# EAGLE design Control Board (EAGLE 9.6.2)
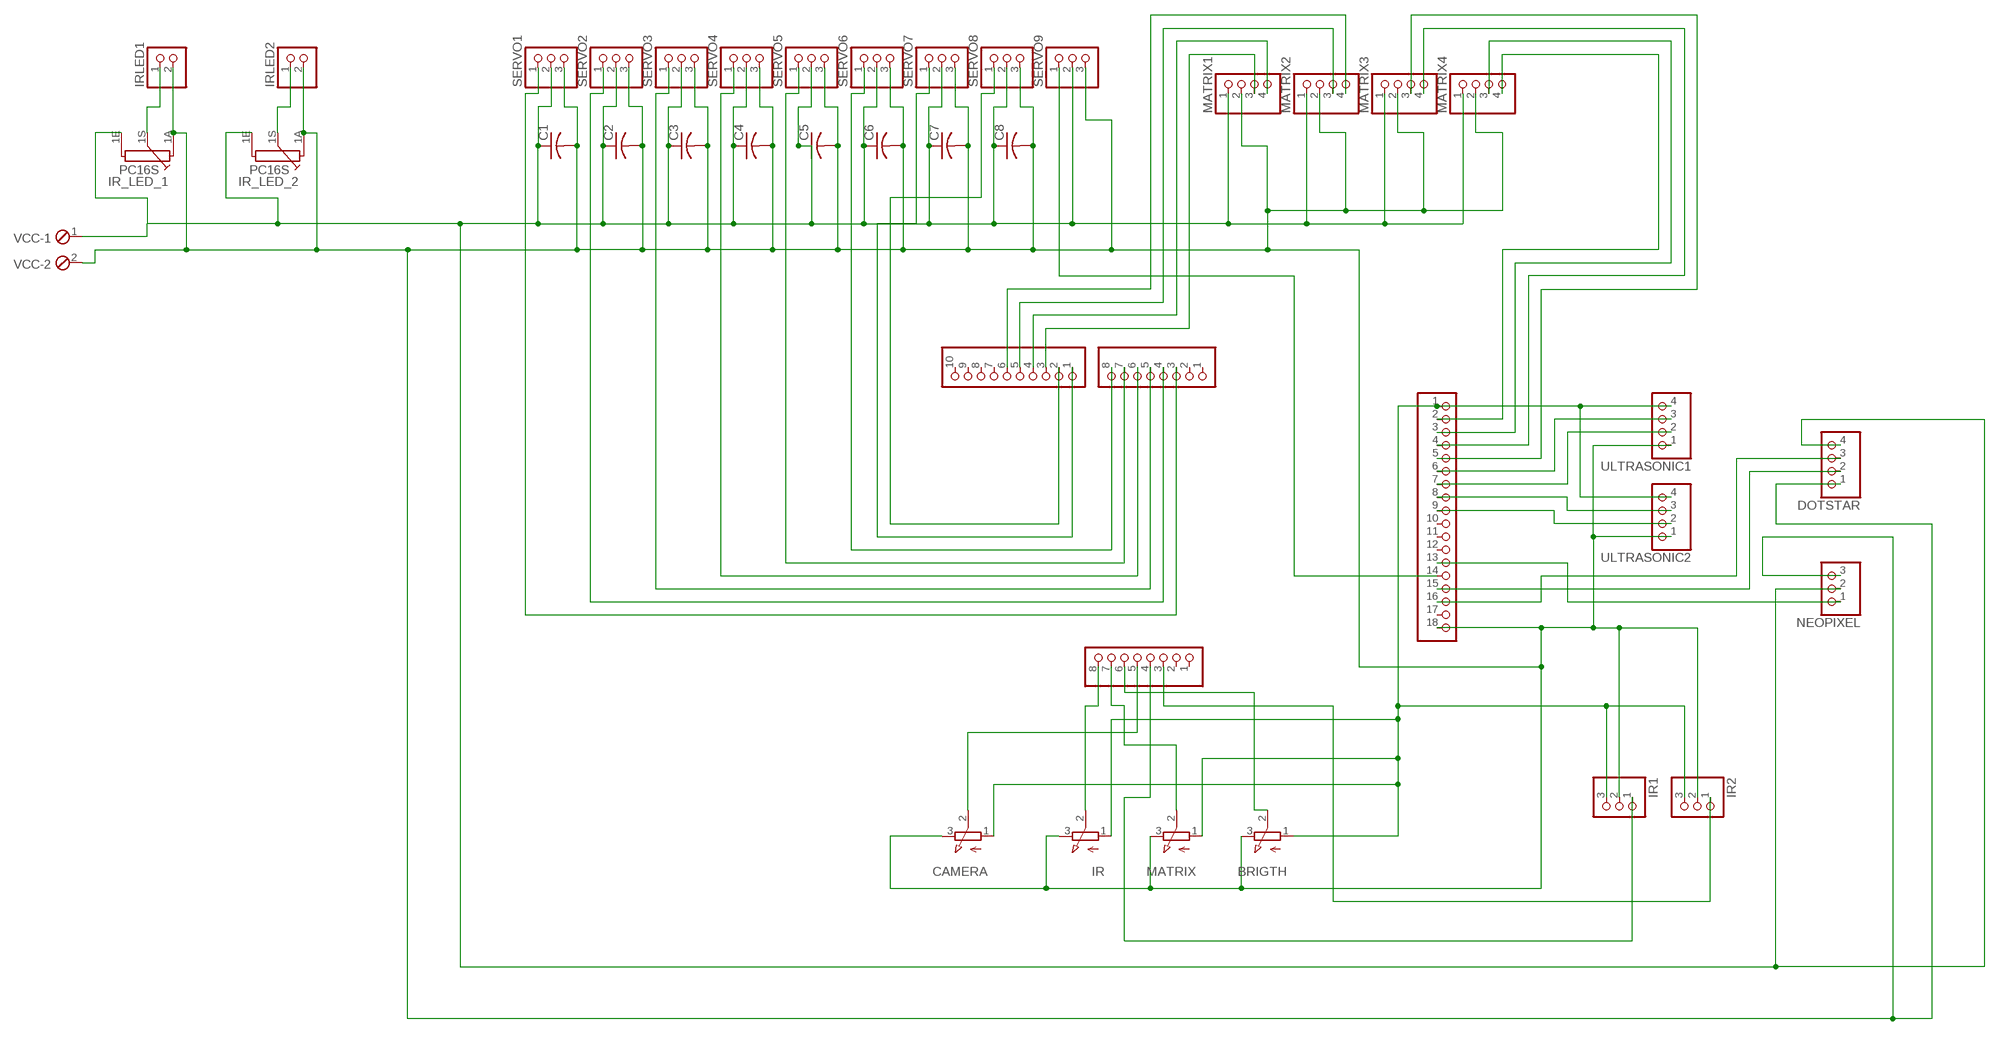
[diagram p0: schematic, sheet 1]

## Parts
BRIGTH  3RP/1610N  [3RP/1610N]
C1  C-US050-030X075  [C050-030X075]
C2  C-US050-030X075  [C050-030X075]
C3  C-US050-030X075  [C050-030X075]
C4  C-US050-030X075  [C050-030X075]
C5  C-US050-030X075  [C050-030X075]
C6  C-US050-030X075  [C050-030X075]
C7  C-US050-030X075  [C050-030X075]
C8  C-US050-030X075  [C050-030X075]
CAMERA  3RP/1610N  [3RP/1610N]
DOTSTAR  PINHD-1X4  [1X04]
IR  3RP/1610N  [3RP/1610N]
IR1  PINHD-1X3  [1X03]
IR2  PINHD-1X3  [1X03]
IR_LED_1  PC16S  [PC16S]
IR_LED_2  PC16S  [PC16S]
IRLED1  PINHD-1X2  [1X02]
IRLED2  PINHD-1X2  [1X02]
MATRIX  3RP/1610N  [3RP/1610N]
MATRIX1  PINHD-1X4  [1X04]
MATRIX2  PINHD-1X4  [1X04]
MATRIX3  PINHD-1X4  [1X04]
MATRIX4  PINHD-1X4  [1X04]
MEGABOTTOMCENTER  PINHD-1X8  [1X08]
MEGALATERAL  PINHD-1X18  [1X18]
MEGATOPCENTER  PINHD-1X8  [1X08]
MEGATOPLEFT  PINHD-1X10_ARD  [1X10]
NEOPIXEL  PINHD-1X3  [1X03]
SERVO1  PINHD-1X3  [1X03]
SERVO2  PINHD-1X3  [1X03]
SERVO3  PINHD-1X3  [1X03]
SERVO4  PINHD-1X3  [1X03]
SERVO5  PINHD-1X3  [1X03]
SERVO6  PINHD-1X3  [1X03]
SERVO7  PINHD-1X3  [1X03]
SERVO8  PINHD-1X3  [1X03]
SERVO9  PINHD-1X3  [1X03]
ULTRASONIC1  PINHD-1X4  [1X04]
ULTRASONIC2  PINHD-1X4  [1X04]
VCC  MPT2  [2POL254]

## Nets
N$1: MATRIX1.3 MEGATOPLEFT.3
N$2: IR.2(S) MEGABOTTOMCENTER.8
N$3: MATRIX.2(S) MEGABOTTOMCENTER.7
N$4: BRIGTH.2(S) MEGABOTTOMCENTER.6
N$5: BRIGTH.1(A) CAMERA.1(A) IR1.3 IR2.3 IR.1(A) MATRIX.1(A) MEGALATERAL.1 ULTRASONIC1.4 ULTRASONIC2.4
N$6: MEGALATERAL.7 ULTRASONIC1.2
N$7: MEGALATERAL.6 ULTRASONIC1.3
N$8: MEGALATERAL.8 ULTRASONIC2.3
N$9: MEGALATERAL.9 ULTRASONIC2.2
N$10: CAMERA.2(S) MEGABOTTOMCENTER.5
N$11: MATRIX1.4 MEGATOPLEFT.4
N$12: MATRIX2.3 MEGATOPLEFT.5
N$13: MATRIX2.4 MEGATOPLEFT.6
N$15: MATRIX3.3 MEGALATERAL.5
N$16: MATRIX3.4 MEGALATERAL.4
N$17: MATRIX4.3 MEGALATERAL.3
N$18: MATRIX4.4 MEGALATERAL.2
N$19: DOTSTAR.2 MEGALATERAL.15
N$20: IR_LED_2.1S IRLED2.1
N$21: IR1.1 MEGABOTTOMCENTER.4
N$22: IR2.1 MEGABOTTOMCENTER.3
N$23: MEGALATERAL.13 NEOPIXEL.1
N$25: DOTSTAR.3 MEGALATERAL.16
N$26: MEGALATERAL.14 SERVO9.1
N$27: C1.1 C2.1 C3.1 C4.1 C5.1 C6.1 C7.1 C8.1 DOTSTAR.4 IR_LED_1.1E IR_LED_2.1E MATRIX1.1 MATRIX2.1 MATRIX3.1 MATRIX4.1 NEOPIXEL.2 SERVO1.2 SERVO2.2 SERVO3.2 SERVO4.2 SERVO5.2 SERVO6.2 SERVO7.2 SERVO8.2 SERVO9.2 VCC.1
N$28: BRIGTH.3(E) C1.2 C2.2 C3.2 C4.2 C5.2 C6.2 C7.2 C8.2 CAMERA.3(E) DOTSTAR.1 IR1.2 IR2.2 IR.3(E) IR_LED_1.1A IR_LED_2.1A IRLED1.2 IRLED2.2 MATRIX1.2 MATRIX2.2 MATRIX3.2 MATRIX4.2 MATRIX.3(E) MEGALATERAL.18 NEOPIXEL.3 SERVO1.3 SERVO2.3 SERVO3.3 SERVO4.3 SERVO5.3 SERVO6.3 SERVO7.3 SERVO8.3 SERVO9.3 ULTRASONIC1.1 ULTRASONIC2.1 VCC.2
N$30: MEGATOPCENTER.3 SERVO1.1
N$31: MEGATOPCENTER.4 SERVO2.1
N$32: MEGATOPCENTER.5 SERVO3.1
N$33: MEGATOPCENTER.6 SERVO4.1
N$34: MEGATOPLEFT.1 SERVO7.1
N$35: MEGATOPCENTER.7 SERVO5.1
N$36: MEGATOPCENTER.8 SERVO6.1
N$37: MEGATOPLEFT.2 SERVO8.1
N$39: IR_LED_1.1S IRLED1.1
Unconnected: MEGABOTTOMCENTER.1 MEGABOTTOMCENTER.2 MEGALATERAL.10 MEGALATERAL.11 MEGALATERAL.12 MEGALATERAL.17 MEGATOPCENTER.1 MEGATOPCENTER.2 MEGATOPLEFT.7 MEGATOPLEFT.8 MEGATOPLEFT.9 MEGATOPLEFT.10

## Library data of the parts
BRIGTH CAMERA IR MATRIX = pot:3RP/1610N: 16mm Potentiometer one level Source: http://www.alphapotentiometers.net/html/16mm_pot_2.html
C1-C8 = rcl:C-US: CAPACITOR, American symbol; SPICEPREFIX: C
DOTSTAR MATRIX1-MATRIX4 ULTRASONIC1 ULTRASONIC2 = pinhead:PINHD-1X4: PIN HEADER
IR1 IR2 NEOPIXEL SERVO1-SERVO9 = pinhead:PINHD-1X3: PIN HEADER
IR_LED_1 IR_LED_2 = piher:PC16S: POTENTIOMETER single carbon potentiometer, 16 mm, S3ROH; OC_FARNELL: 4452940; OC_NEWARK: unknown
IRLED1 IRLED2 = pinhead:PINHD-1X2: PIN HEADER
MEGABOTTOMCENTER MEGATOPCENTER = SmartPrj:PINHD-1X8: PIN HEADER
MEGALATERAL = pinhead:PINHD-1X18: PIN HEADER
MEGATOPLEFT = SmartPrj:PINHD-1X10_ARD: PIN HEADER
VCC = con-phoenix-254:MPT2: PHOENIX CONNECTOR; OC_FARNELL: unknown; OC_NEWARK: unknown

## Board
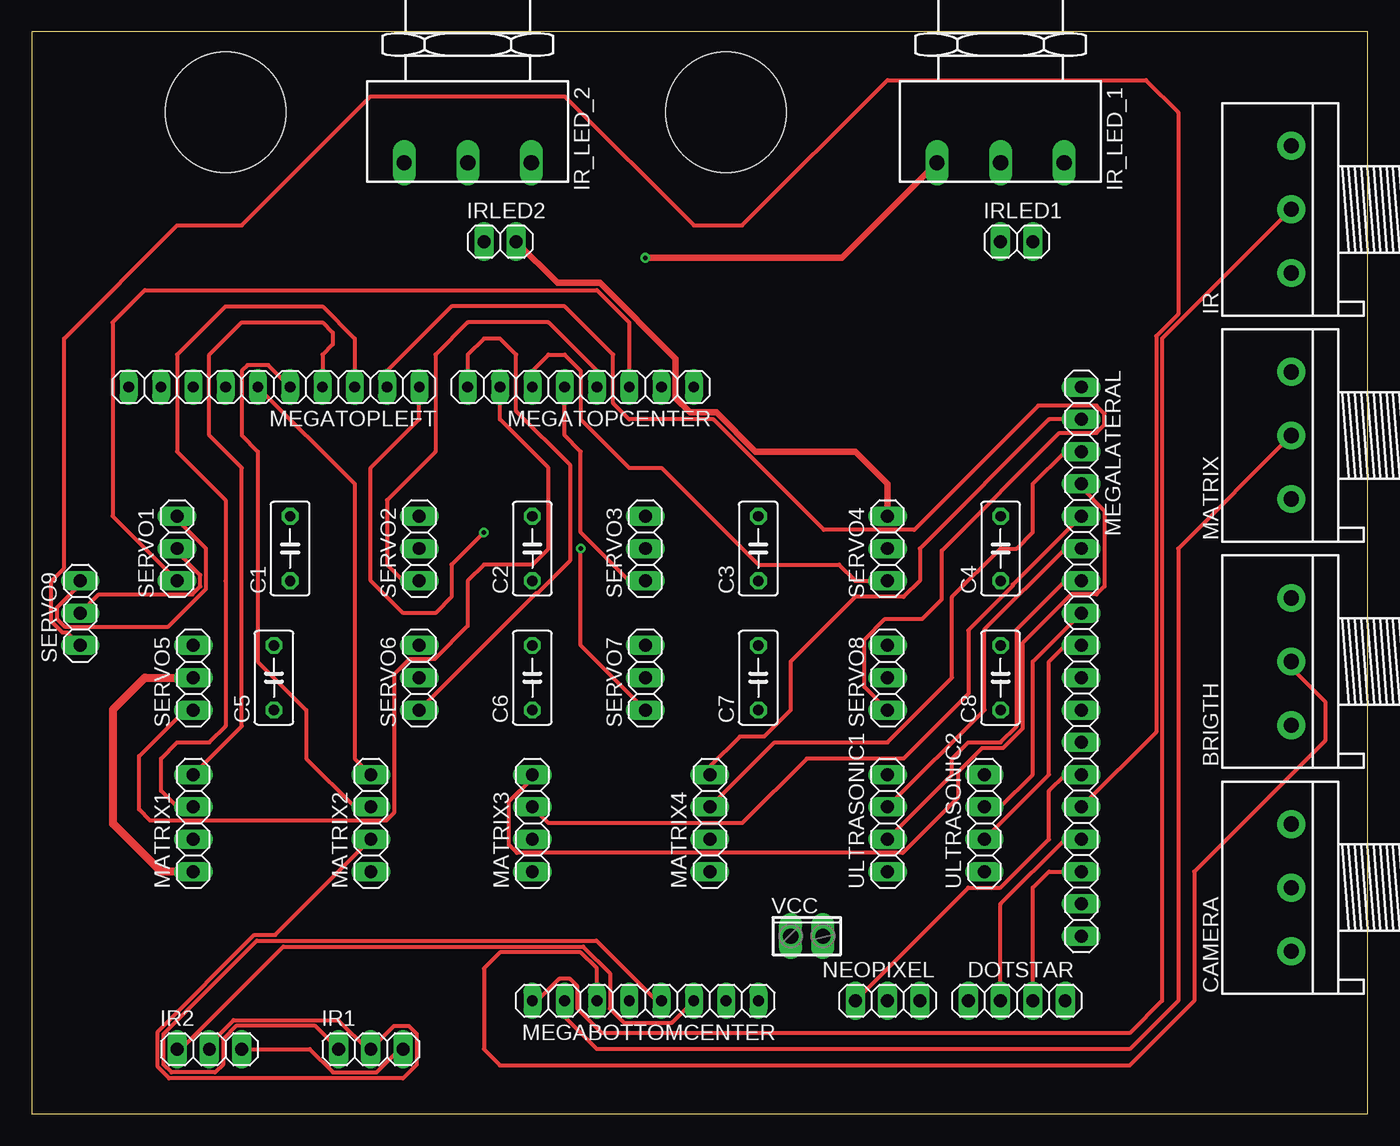
[diagram p1: board, top side]
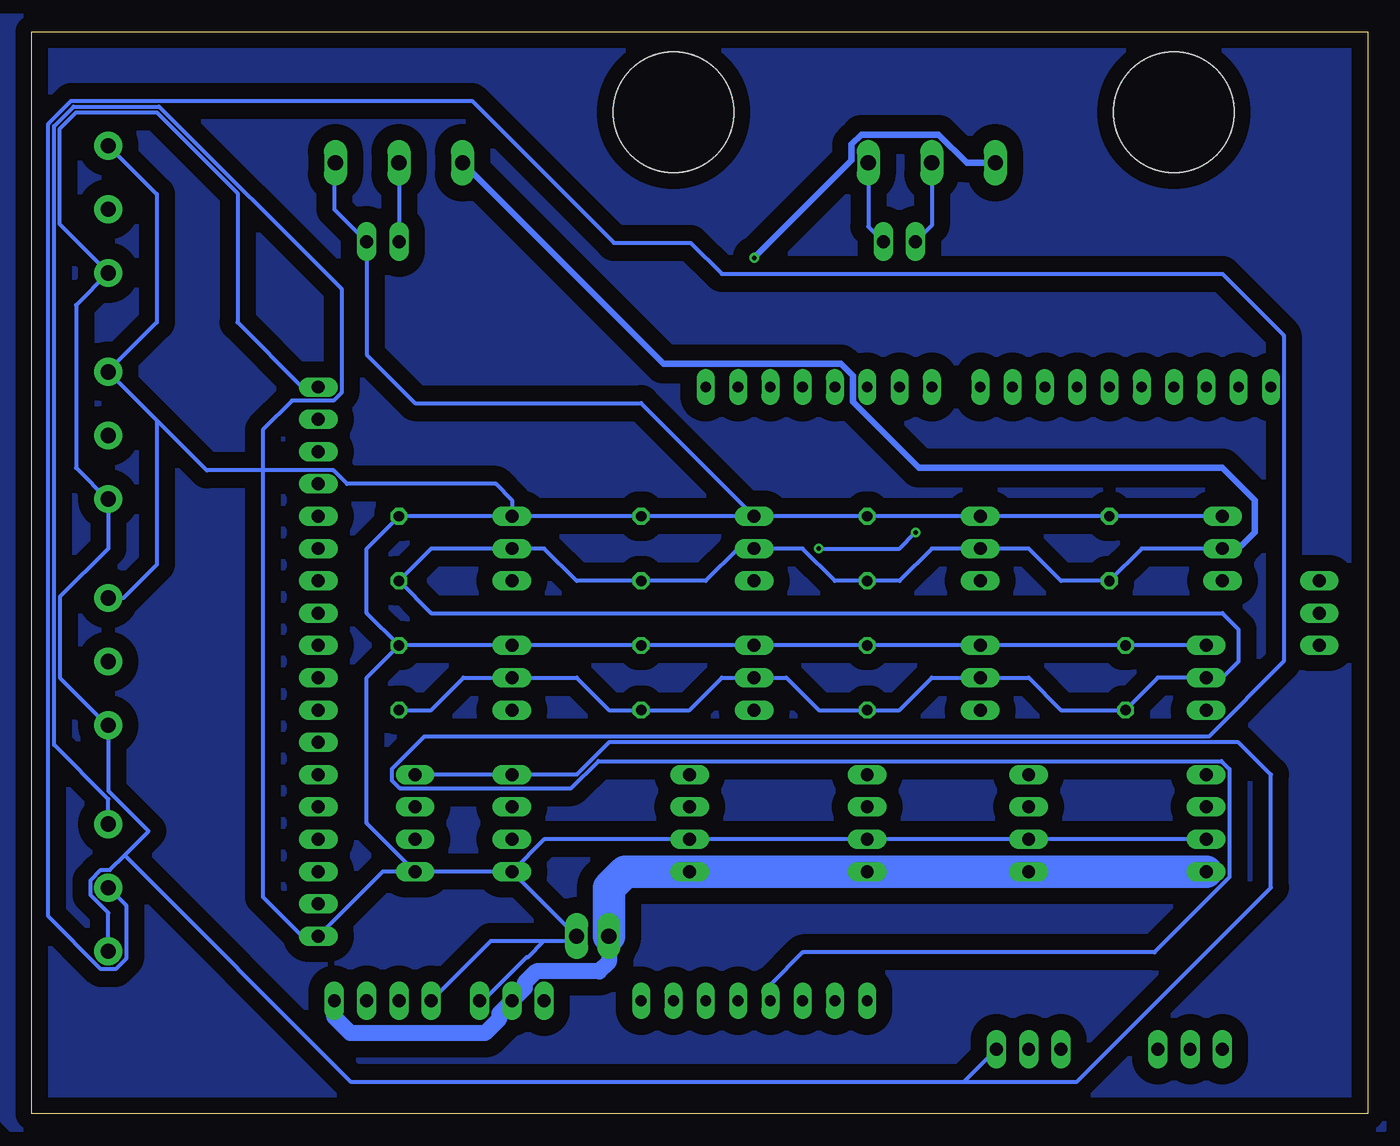
[diagram p2: board, bottom side, seen from below]

Size 105.08 x 85.08 mm. Coordinates in mm from the lower left corner, seen from the top.
Outline: 0,0 105.08,0 105.08,85.08 0,85.08 0,0
Copper layers (1*16): Top 0.035mm / dielectric 1.5mm / Bottom 0.035mm
Design rules "default": minimum track width 6mil, minimum drill 0.35mm, track to track 6mil, track to pad 6mil, pad to pad 6mil, via to via 6mil, smd to smd 6mil, copper to edge 40mil, drill to drill 6mil, minimum pad ring 10mil, minimum via ring 8mil, stop-mask expansion 4mil, vias tented up to drill 0mil, thermal gap 10mil
Holes 9.5 mm at 54.61,78.74 15.24,78.74

### Footprints (pad centres in the part's own frame; a part is rotated, then mirrored left to right if it is on the bottom)
3RP/1610N = drill 1.2 pad 2.184: 1 -5,0; 2 0,0; 3 5,0
C050-030X075 = drill 0.813 octagon: 1 -2.54,0; 2 2.54,0
1X04 = drill 1.016 long: 1 -3.81,0; 2 -1.27,0; 3 1.27,0; 4 3.81,0
1X03 = drill 1.016 long: 1 -2.54,0; 2 0,0; 3 2.54,0
PC16S = drill 1.2 long: 1A -5,6.5; 1E 5,6.5; 1S 0,6.5
1X02 = drill 1.016 long: 1 -1.27,0; 2 1.27,0
1X08 = drill 0.85 pad 1.422 long: 1 -8.89,0; 2 -6.35,0; 3 -3.81,0; 4 -1.27,0; 5 1.27,0; 6 3.81,0; 7 6.35,0; 8 8.89,0
1X18 = drill 1.016 long: 1 -21.59,0; 2 -19.05,0; 3 -16.51,0; 4 -13.97,0; 5 -11.43,0; 6 -8.89,0; 7 -6.35,0; 8 -3.81,0; 9 -1.27,0; 10 1.27,0; 11 3.81,0; 12 6.35,0; 13 8.89,0; 14 11.43,0; 15 13.97,0; 16 16.51,0; 17 19.05,0; 18 21.59,0
1X10 = drill 0.85 pad 1.422 long: 1 -11.43,0; 2 -8.89,0; 3 -6.35,0; 4 -3.81,0; 5 -1.27,0; 6 1.27,0; 7 3.81,0; 8 6.35,0; 9 8.89,0; 10 11.43,0
2POL254 = drill 1.2 long: 1 -1.27,0; 2 1.27,0

### Placement (x,y rotation side)
BRIGTH  99.06,35.56 90 top
C1  20.32,44.45 90 top
C2  39.37,44.45 90 top
C3  57.15,44.45 90 top
C4  76.2,44.45 90 top
C5  19.05,34.29 90 top
C6  39.37,34.29 90 top
C7  57.15,34.29 90 top
C8  76.2,34.29 90 top
CAMERA  99.06,17.78 90 top
DOTSTAR  77.47,8.89 0 top
IR  99.06,71.12 90 top
IR1  26.67,5.08 0 top
IR2  13.97,5.08 0 top
IR_LED_1  76.2,81.28 180 top
IR_LED_2  34.29,81.28 180 top
IRLED1  77.47,68.58 0 top
IRLED2  36.83,68.58 0 top
MATRIX  99.06,53.34 90 top
MATRIX1  12.7,22.86 90 top
MATRIX2  26.67,22.86 90 top
MATRIX3  39.37,22.86 90 top
MATRIX4  53.34,22.86 90 top
MEGABOTTOMCENTER  48.26,8.89 180 top
MEGALATERAL  82.55,35.56 270 top
MEGATOPCENTER  43.18,57.15 180 top
MEGATOPLEFT  19.05,57.15 180 top
NEOPIXEL  67.31,8.89 0 top
SERVO1  11.43,44.45 90 top
SERVO2  30.48,44.45 90 top
SERVO3  48.26,44.45 90 top
SERVO4  67.31,44.45 90 top
SERVO5  12.7,34.29 90 top
SERVO6  30.48,34.29 90 top
SERVO7  48.26,34.29 90 top
SERVO8  67.31,34.29 90 top
SERVO9  3.81,39.37 90 top
ULTRASONIC1  67.31,22.86 90 top
ULTRASONIC2  74.93,22.86 90 top
VCC  60.96,13.97 0 top

### Tracks (layer width: path | path; a pad name or v marks a point on that pad's centre or on a via)
N$1
  Top 0.305: 25.4,58.42 MEGATOPLEFT.3 25.4,60.96 22.86,63.5 15.24,63.5 11.43,59.69 11.43,52.07 15.24,48.26 15.24,41.91 15.24,30.48 13.97,29.21 11.43,29.21 10.16,27.94 10.16,25.4 11.43,24.13 MATRIX1.3
N$2
  Top 0.305: IR.2 88.9,60.96 88.9,8.89 86.36,6.35 44.84,6.35 42.93,8.27 42.93,10.02 42.33,10.62 41.49,10.62 39.76,8.89 MEGABOTTOMCENTER.8
N$3
  Top 0.305: MATRIX.2 90.17,44.45 90.17,8.89 86.36,5.08 44.45,5.08 41.91,7.62 MEGABOTTOMCENTER.7
N$4
  Top 0.305: BRIGTH.2 99.06,35.08 101.73,32.41 101.73,29.34 91.44,19.05 91.44,8.89 86.36,3.81 36.83,3.81 35.56,5.08 35.56,11.43 36.83,12.7 43.18,12.7 44.45,11.43 MEGABOTTOMCENTER.6
N$5
  Top 0.305: IR2.3 21.86,5.08 23.69,3.25 27.11,3.25 28.94,5.08 IR1.3
  Bottom 0.305: MATRIX.1 99.06,48.26 | 99.06,48.26 99.06,44.45 102.87,40.64 102.87,34.29 99.06,30.48 BRIGTH.1 99.06,25.4 95.89,22.22 97.79,20.32 | 99.06,48.26 101.6,50.8 101.6,63.58 IR.1 102.87,69.93 102.87,77.47 101.6,78.74 95.25,78.74 88.9,72.39 88.9,62.23 83.82,57.15 MEGALATERAL.1 | 97.79,20.32 80.01,2.54 31.75,2.54 | 31.75,2.54 22.86,2.54 7.62,17.78 7.62,26.67 10.16,29.21 59.69,29.21 62.23,26.67 ULTRASONIC1.4 ULTRASONIC2.4 | IR1.3 31.75,2.54 | 97.79,20.32 98.93,19.18 99.64,19.18 100.46,18.36 100.46,17.2 99.06,15.8 CAMERA.1
N$6
  Top 0.305: ULTRASONIC1.2 72.39,26.67 72.39,27.94 73.66,29.21 76.2,29.21 77.47,30.48 77.47,38.1 81.28,41.91 MEGALATERAL.7
N$7
  Top 0.305: ULTRASONIC1.3 74.93,31.75 74.93,38.1 81.28,44.45 MEGALATERAL.6
N$8
  Top 0.305: MEGALATERAL.8 78.74,35.56 78.74,26.67 76.2,24.13 ULTRASONIC2.3
N$9
  Top 0.305: MEGALATERAL.9 81.28,36.83 80.01,35.56 80.01,26.67 ULTRASONIC2.2
N$10
  Bottom 0.305: CAMERA.2 97.66,16.38 97.66,12.2 98.48,11.38 99.64,11.38 103.78,15.53 103.78,77.85 101.98,79.65 70.45,79.65 59.29,68.49 53.25,68.49 50.8,66.04 11.43,66.04 6.6,61.21 6.6,35.58 12.51,29.67 74.2,29.67 76.76,27.11 76.76,26.23 76.13,25.6 62.65,25.6 60.52,27.74 11.5,27.74 10.87,27.11 10.87,18.61 16.78,12.7 44.45,12.7 46.99,10.16 MEGABOTTOMCENTER.5
N$11
  Top 0.305: MATRIX1.4 16.51,30.48 16.51,50.8 13.97,53.34 13.97,59.69 16.51,62.23 22.86,62.23 23.67,61.42 23.67,60.5 22.86,59.69 MEGATOPLEFT.4
N$12
  Top 0.305: MATRIX2.3 25.4,24.13 21.59,27.94 21.59,31.75 17.78,35.56 17.78,52.07 16.51,53.34 16.51,58.42 16.97,58.88 18.59,58.88 MEGATOPLEFT.5
N$13
  Top 0.305: MEGATOPLEFT.6 25.4,49.53 25.4,27.94 MATRIX2.4
N$15
  Top 0.305: MEGALATERAL.5 77.16,41.61 77.16,41.51 73.66,38.01 73.66,33.02 68.58,27.94 60.96,27.94 55.88,22.86 40.64,22.86 MATRIX3.3
N$16
  Top 0.305: MEGALATERAL.4 82.55,49.26 84.38,47.43 84.38,41.47 83.75,40.84 81.75,40.84 77.93,37.02 77.93,30.29 76.39,28.75 74.74,28.75 72.85,26.86 72.85,24.86 68.51,20.52 38.17,20.52 37.54,21.15 37.54,24.57 39.37,26.4 MATRIX3.4
N$17
  Top 0.305: MATRIX4.3 58.42,29.21 67.31,29.21 72.39,34.29 72.39,40.64 76.2,44.45 77.47,44.45 78.74,45.72 78.74,49.53 81.28,52.07 MEGALATERAL.3
N$18
  Top 0.305: MEGALATERAL.2 80.01,54.61 69.85,44.45 69.85,41.91 68.58,40.64 64.77,40.64 59.69,35.56 59.69,31.75 57.61,29.67 55.69,29.67 53.34,27.32 MATRIX4.4
N$19
  Top 0.305: DOTSTAR.2 76.2,16.51 81.28,21.59 MEGALATERAL.15
N$20
  Bottom 0.305: IRLED2.1 34.29,69.85 IR_LED_2.1S
N$21
  Top 0.305: MEGABOTTOMCENTER.4 49.14,8.89 44.41,13.61 17.69,13.61 10.36,6.28 10.36,3.88 10.99,3.25 14.41,3.25 15.04,3.88 15.04,5.88 16.07,6.91 22.3,6.91 IR1.1
N$22
  Top 0.305: IR2.1 11.7,5.08 19.78,13.16 43.37,13.16 45.47,11.06 45.47,8.27 46.57,7.16 50.34,7.16 MEGABOTTOMCENTER.3
N$23
  Top 0.305: NEOPIXEL.1 73.66,17.78 76.2,17.78 80.01,21.59 80.01,25.4 81.28,26.67 MEGALATERAL.13
N$25
  Top 0.305: DOTSTAR.3 78.74,17.78 80.01,19.05 MEGALATERAL.16
N$26
  Top 0.305: SERVO9.1 2.79,37.85 2.42,37.85 1.52,38.74 1.52,41.9 2.54,42.91 2.54,60.96 11.43,69.85 16.51,69.85 26.67,80.01 41.91,80.01 52.07,69.85 55.88,69.85 67.31,81.28 87.63,81.28 90.17,78.74 90.17,62.88 88.44,61.15 88.44,30.02 MEGALATERAL.14
N$27  (via drill 0.35)
  Top 0.305: SERVO9.2 5.28,40.84 12.63,40.84 13.26,41.47 13.26,42.35 11.43,44.18 SERVO1.2
  Top 0.508: v48.26,67.31 63.73,67.31 IR_LED_1.1E
  Top 0.61: MATRIX1.1 10.16,19.05 6.4,22.81 6.4,31.8 8.89,34.29 SERVO5.2
  Bottom 0.305: SERVO1.2 17.78,44.45 C1.1 24.13,41.91 26.67,44.45 SERVO2.2 34.29,44.45 36.83,41.91 C2.1 41.91,41.91 44.45,44.45 SERVO3.2 49.53,44.45 52.07,41.91 C3.1 62.23,41.91 64.77,44.45 SERVO4.2 73.66,44.45 C4.1 73.66,39.37 11.43,39.37 10.16,38.1 10.16,35.56 11.43,34.29 SERVO5.2 16.51,34.29 C5.1 24.13,31.75 26.67,34.29 SERVO6.2 34.29,34.29 36.83,31.75 C6.1 43.18,31.75 45.72,34.29 SERVO7.2 50.8,34.29 53.34,31.75 C7.1 59.69,31.75 62.23,34.29 SERVO8.2 71.12,34.29 73.66,31.75 C8.1 76.37,31.58 | 71.2,75.01 IR_LED_1.1E
  Bottom 0.508: IR_LED_1.1E 55.4,58.98 41.45,58.98 40.49,58.02 40.49,55.98 35.31,50.8 11.43,50.8 8.89,48.26 8.89,45.72 10.16,44.45 SERVO1.2 | IR_LED_2.1E 31.54,74.78 33.75,76.99 39.83,76.99 40.6,76.22 40.6,74.97 v48.26,67.31
  Bottom 1.27: VCC.1 59.69,11.95 60.44,11.2 65.41,11.2 66.32,10.29 66.32,9.88 NEOPIXEL.2 68.3,7.9 68.3,7.49 69.44,6.35 80.01,6.35 81.28,7.62 DOTSTAR.4
  Bottom 2.54: VCC.1 59.69,17.78 58.42,19.05 MATRIX4.1 MATRIX3.1 MATRIX2.1 MATRIX1.1
N$28
  Top 0.305: IR2.2 14.58,5.69 14.58,6.07 15.88,7.37 24.12,7.37 26.4,5.08 IR1.2 28.5,6.91 29.65,6.91 30.28,6.28 30.28,3.88 29.2,2.79 10.8,2.79 9.91,3.69 9.91,6.47 17.5,14.07 19.15,14.07 MATRIX2.2 | SERVO9.3 3.81,41.64 1.98,39.81 1.98,38.93 2.61,38.3 10.74,38.3 13.72,41.28 13.72,44.44 11.43,46.72 SERVO1.3
  Top 0.508: IRLED2.2 41.35,65.33 44.68,65.33 50.65,59.36 50.65,56.28 51.76,55.17 53.84,55.17 56.94,52.07 64.77,52.07 67.31,49.53 SERVO4.3
  Bottom 0.305: SERVO5.3 C5.2 SERVO6.3 C6.2 SERVO7.3 C7.2 SERVO8.3 C8.2 | SERVO1.3 C1.2 SERVO2.3 C2.2 SERVO3.3 | 49.53,46.99 SERVO3.3 | SERVO3.3 C3.2 SERVO4.3 | SERVO4.3 C4.2 78.74,44.45 78.74,39.37 C8.2 | IR_LED_1.1A 81.28,74.7 81.28,71.12 IRLED1.2 78.74,59.69 74.93,55.88 57.15,55.88 SERVO3.3 | SERVO4.3 67.31,48.26 68.58,49.53 80.28,49.53 81.35,50.6 91.32,50.6 MATRIX.3 | IR.3 95.25,72.31 95.25,62.23 99.06,58.42 MATRIX.3 | MATRIX.3 95.25,54.53 95.25,43.18 97.87,40.56 BRIGTH.3 | ULTRASONIC1.1 ULTRASONIC2.1 | ULTRASONIC2.1 77.47,19.05 MEGALATERAL.18 83.82,13.97 86.92,17.07 86.92,53.78 84.62,56.08 81.35,56.08 80.72,56.71 80.72,64.86 95.06,79.2 101.79,79.2 103.33,77.66 103.33,29.02 99.06,24.75 CAMERA.3 | ULTRASONIC1.1 66.04,19.05 | ULTRASONIC2.1 78.74,22.86 78.74,34.29 C8.2 | ULTRASONIC1.1 VCC.2 62.61,13.59 64.77,13.59 | MATRIX1.2 MATRIX2.2 MATRIX3.2 MATRIX4.2 64.77,21.59 ULTRASONIC1.1 | IRLED2.2 39.29,69.77 IR_LED_2.1A | NEOPIXEL.3 69.58,8.89 66.15,12.32 66.04,12.32 64.77,13.59 | DOTSTAR.1 68.96,13.59 64.77,13.59
N$29
  pour Bottom (isolate 1.27): -1.27,-1.27 106.68,-1.27 107.95,0 107.95,86.36 1.27,86.36 -1.27,83.82
N$30
  Top 0.305: MEGATOPCENTER.3 46.99,62.23 44.45,64.77 8.89,64.77 6.35,62.23 6.35,46.99 SERVO1.1
N$31
  Top 0.305: MEGATOPCENTER.4 44.45,58.42 40.64,62.23 34.29,62.23 31.75,59.69 31.75,52.07 27.94,48.26 27.94,43.18 29.21,41.91 SERVO2.1
N$32
  Top 0.305: SERVO3.1 46.99,41.91 43.18,45.72 43.18,52.07 41.91,53.34 MEGATOPCENTER.5
N$33
  Top 0.305: SERVO4.1 64.77,41.91 63.5,43.18 57.15,43.18 49.53,50.8 46.99,50.8 43.18,54.61 43.18,58.42 41.91,59.69 40.64,59.69 39.37,58.42 MEGATOPCENTER.6
N$34  (via drill 0.35)
  Top 0.305: SERVO7.1 43.18,36.83 v43.18,44.45 | v35.56,45.72 33.02,43.18 33.02,40.64 31.75,39.37 29.21,39.37 26.67,41.91 26.67,50.8 30.48,54.61 MEGATOPLEFT.1
  Bottom 0.305: v43.18,44.45 36.83,44.45 v35.56,45.72
N$35
  Top 0.305: SERVO5.1 12.05,31.75 8.43,28.13 8.43,23.94 9.31,23.06 27.87,23.06 28.5,23.69 28.5,34.58 29.68,35.76 31.68,35.76 34.29,38.37 34.29,41.91 35.56,43.18 39.37,43.18 40.64,44.45 40.64,50.8 36.83,54.61 MEGATOPCENTER.7
N$36
  Top 0.305: SERVO6.1 39.67,40.95 39.77,40.95 42.37,43.54 42.37,50.99 38.1,55.26 38.1,59.69 36.83,60.96 35.56,60.96 34.29,59.69 MEGATOPCENTER.8
N$37
  Top 0.305: SERVO8.1 65.48,33.58 65.48,37.27 67.12,38.91 70.04,38.91 71.58,40.45 71.58,44.28 80.84,53.54 83.75,53.54 84.38,54.17 84.38,55.05 83.75,55.68 79.16,55.68 69.41,45.92 62.3,45.92 53.61,54.61 46.99,54.61 45.72,55.88 45.72,59.69 41.91,63.5 33.02,63.5 27.94,58.42 MEGATOPLEFT.2
N$39
  Bottom 0.305: IR_LED_1.1S IRLED1.1